# Altium schematic sheet FEEL_2021.SchDoc: FEEL 2021
size A4; CheckedBy: -; Author: Carlos Barba, Efrén Boyarizo; CompanyName: ETSIT; DrawnBy: -; Revision: V1.0; SheetNumber: 1; SheetTotal: 5
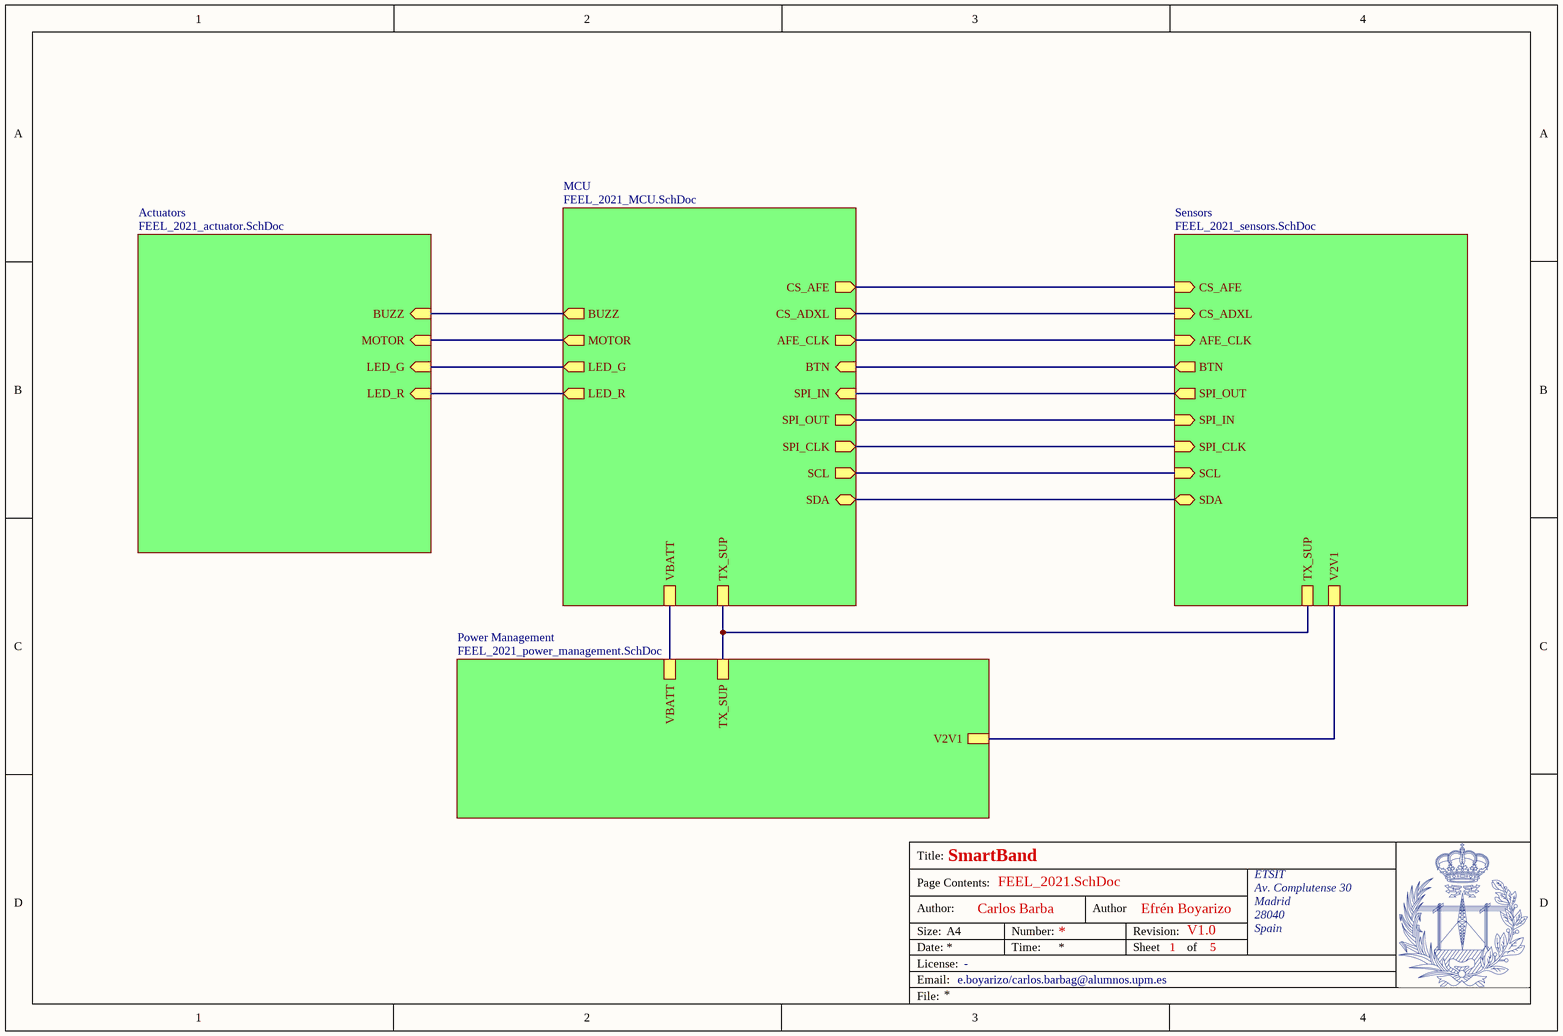
[diagram p0: FEEL_2021.SchDoc]

## Sub-sheets
Actuators = FEEL_2021_actuator.SchDoc: MOTOR (in), LED_G (in), LED_R (in), BUZZ (in)
MCU = FEEL_2021_MCU.SchDoc: SDA (bidir), SCL (out), SPI_CLK (out), SPI_OUT (out), SPI_IN (in), AFE_CLK (out), CS_ADXL (out), VBATT, TX_SUP, BTN (in), LED_G (out), LED_R (out), MOTOR (out), BUZZ (out), CS_AFE (out)
Power Management = FEEL_2021_power_management.SchDoc: TX_SUP, VBATT, V2V1
Sensors = FEEL_2021_sensors.SchDoc: SDA (bidir), SCL (in), SPI_CLK (in), SPI_IN (in), SPI_OUT (out), AFE_CLK (in), CS_ADXL (in), V2V1, BTN (out), TX_SUP, CS_AFE (in)

## Nets
(unnamed): sheet Power Management/TX_SUP, sheet MCU/TX_SUP, sheet Sensors/TX_SUP
(unnamed): sheet Power Management/VBATT, sheet MCU/VBATT
(unnamed): sheet Power Management/V2V1, sheet Sensors/V2V1
(unnamed): sheet MCU/SDA, sheet Sensors/SDA
(unnamed): sheet MCU/SCL, sheet Sensors/SCL
(unnamed): sheet MCU/SPI_CLK, sheet Sensors/SPI_CLK
(unnamed): sheet MCU/SPI_OUT, sheet Sensors/SPI_IN
(unnamed): sheet MCU/SPI_IN, sheet Sensors/SPI_OUT
(unnamed): sheet MCU/AFE_CLK, sheet Sensors/AFE_CLK
(unnamed): sheet MCU/CS_ADXL, sheet Sensors/CS_ADXL
(unnamed): sheet MCU/BTN, sheet Sensors/BTN
(unnamed): sheet MCU/LED_G, sheet Actuators/LED_G
(unnamed): sheet MCU/LED_R, sheet Actuators/LED_R
(unnamed): sheet MCU/MOTOR, sheet Actuators/MOTOR
(unnamed): sheet MCU/BUZZ, sheet Actuators/BUZZ
(unnamed): sheet MCU/CS_AFE, sheet Sensors/CS_AFE

## Notes on the sheet
- Title:
- SmartBand
- Author:
- Page Contents:
- Carlos Barba
- Author
- Efrén Boyarizo
- V1.0
- ETSIT
- Av. Complutense 30
- Madrid
- 28040
- Size:
- Date:
- File:
- License:
- Email:
- A4
- e.boyarizo/carlos.barbag@alumnos.upm.es
- -
- Number:
- Time:
- Revision:
- Sheet
- of
- 5
- Spain